# EasyEDA Pro project ProPrj_HydroNodeStation01_2026-04-19.epro, board PCB2
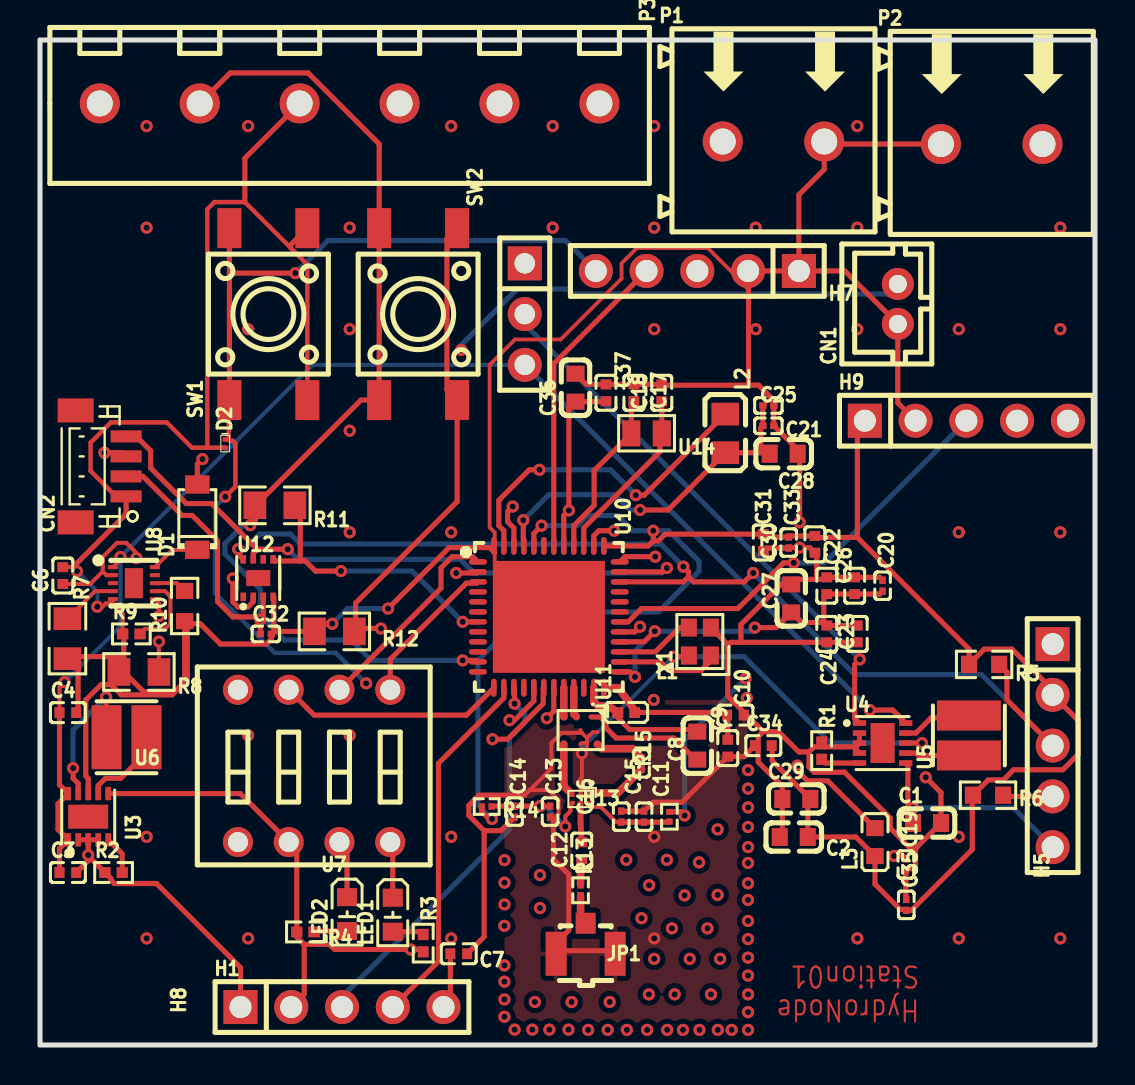
[diagram p2: board, top side]
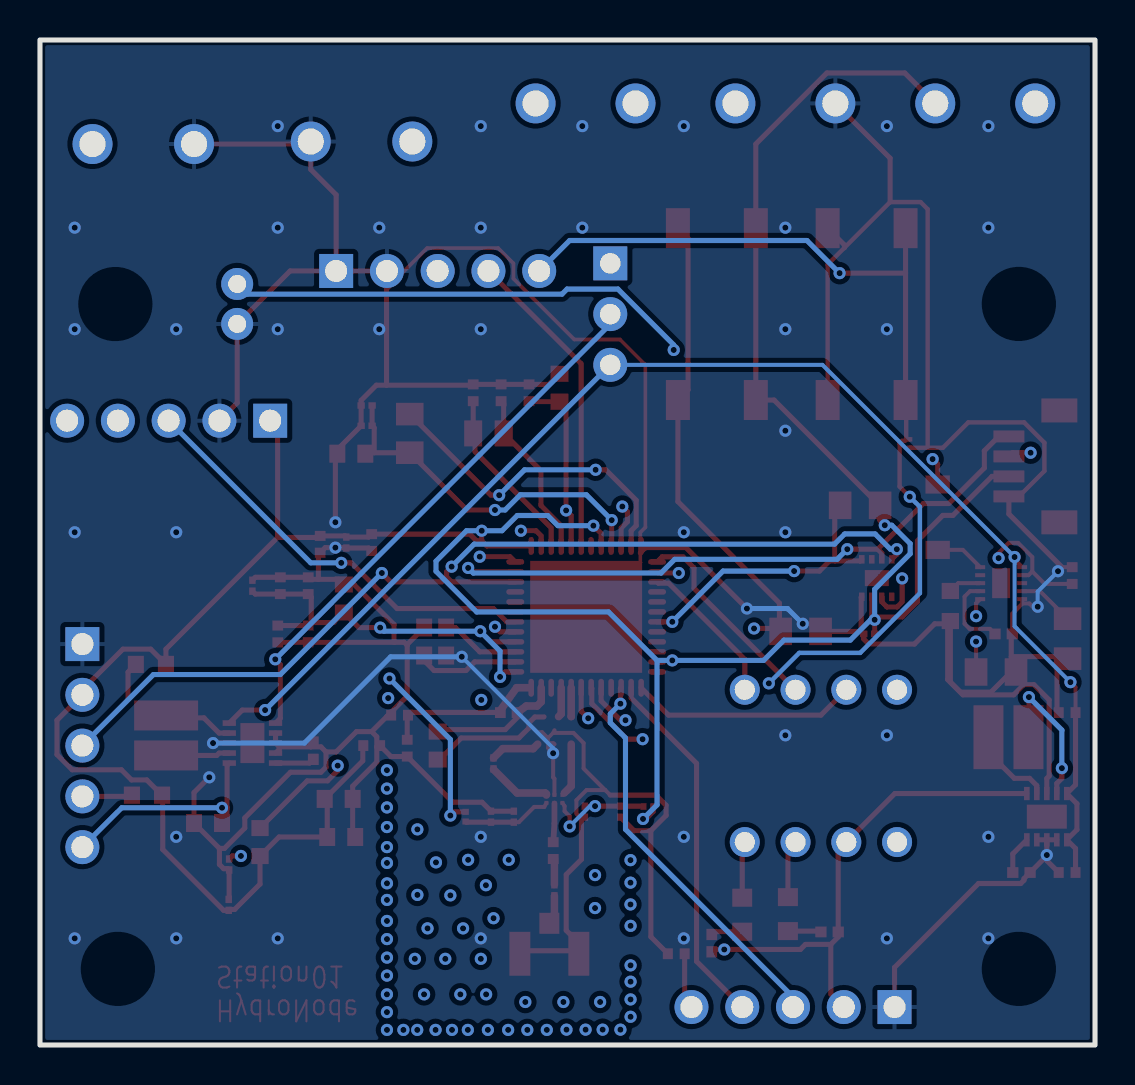
[diagram p3: board, bottom side, seen from below]

Outline 52.79 x 50.29 mm; copper layers: Top Layer, Inner1, Inner2, Bottom Layer. Coordinates in mm from the lower left corner of the outline.
Outline path: rectangle 0,50.29 52.79,0
Stack: Top Layer 0.035mm Outer layer thickness 1oz / Dielectric1 0.2104mm 7628 RC49% 8.6mil er 4.5 / Inner1 0.035mm Inner layer thickness / Dielectric2 1.065mm 1.1mm H/HOZ Copper / Inner2 0.035mm Inner layer thickness / Dielectric3 0.2104mm 7628 RC49% 8.6mil er 4.5 / Bottom Layer 0.035mm Outer layer thickness 1oz

## Design rules (mm)
template: JLCPCB Capability(Two Layers Board)
spacing copperThickness1oz (default): track to track 0.102, other pairs 0.152 to 0.3
spacing copperThickness2oz: track to track 0.203, other pairs 0.152 to 0.3
track width copperThickness1oz (default): min 0.127, default 0.254, max 2.54
track width copperThickness2oz: min 0.203, default 0.254, max 2.54
differential pair differentialPair (default): width min 0.127, default 0.254, max 2.54; gap min 0.152, default 0.152
via viaSize (default): diameter min 0.5, default 0.61, max 10; hole min 0.3, default 0.305, max 6.3

## Placement (name value [footprint] x y rotation side)
C1  22uF  [C0603]  44.38 11.11 0 top
C2  22uF  [C0603]  37.72 10.41 180 top
C3  10uF  [C0402]  1.4 8.63 0 top
C4  10uF  [C0402]  1.4 16.63 0 top
C6  100nF  [C0402]  1.14 23.49 90 top
C7  100nF  [C0402]  20.96 4.57 180 top
C8  100pF  [C0603]  32.89 14.98 90 top
C9  68pF  [C0402]  34.42 14.85 90 top
C10  47nF  [C0402]  34.8 16.5 180 top
C11  68pF  [C0201]  30.1 14.09 90 top
C12  68pF  [C0402]  27.11 9.73 90 top
C13  100nF  [C0201]  25.53 11.68 270 top
C14  1nF  [C0201]  23.75 11.68 270 top
C15  100nF  [C0201]  30.23 11.42 270 top
C16  1nF  [C0201]  29.08 11.42 270 top
C17  6.8pF  [C0402]  29.72 32.63 90 top
C18  6.8pF  [C0402]  31.12 32.63 90 top
C19  100nF  [C0201]  43.33 9.03 270 top
C20  33pF  [C0201]  42.16 22.98 270 top
C21  33pF  [C0201]  36.45 30.98 180 top
C22  100nF  [C0402]  39.37 22.98 270 top
C23  100nF  [C0402]  40.89 20.57 90 top
C24  100nF  [C0402]  39.37 20.57 90 top
C25  33pF  [C0201]  36.45 32 0 top
C26  100nF  [C0402]  40.77 22.98 90 top
C27  4.7uF  [C0603]  37.59 22.35 90 top
C28  470nF  [C0603]  37.21 29.59 0 top
C29  4.7uF  [C0603]  37.85 12.31 0 top
C30  100nF  [C0402]  36.19 25.14 270 top
C31  100nF  [C0402]  38.77 25.05 270 top
C32  100nF  [C0201]  11.3 20.57 0 top
C33  100nF  [C0201]  37.47 25.14 270 top
C34  100nF  [C0402]  36.19 14.98 0 top
C35  100nF  [C0201]  43.35 7.01 270 top
C36  4.7uF  [C0603]  26.8 32.89 90 top
C37  100nF  [C0402]  28.32 32.63 90 top
CN1  B2B-PH-K-S(LF)(SN)  [CONN-TH_B2B-PH-K-S]  42.93 37.08 90 top
CN2  BM04B-SRSS-TB(LF)(SN)  [CONN-SMD_BM04B-SRSS-TB]  3.05 28.95 90 top
D1  MBRX120LF-TP  [SOD-123_L2.7-W1.6-LS3.7-RD]  7.87 26.41 90 top
D2  ESDALC6V1-1U2  [DFN0603-D_L0.6-W0.3-P0.34-RD]  9.27 30.09 270 top
H1  PZ254V-11-05P  [HDR-TH_5P-P2.54-V-M]  15.11 1.9 0 top
H5  PZ254V-11-05P  [HDR-TH_5P-P2.54-V-M]  50.67 14.98 270 top
H7  PZ254V-11-05P  [HDR-TH_5P-P2.54-V-M]  32.89 38.73 180 top
H8  PZ254V-11-03P  [HDR-TH_3P-P2.54-V-M_PZ254V-11-03P]  24.26 36.57 270 top
H9  PZ254V-11-05P  [HDR-TH_5P-P2.54-V-M]  46.35 31.24 0 top
JP1  6GHz  [RF-SMD_FRF05002-JSS103M]  27.31 5.33 180 top
L1  47nH  [L0402]  29.34 16.63 180 top
L2  15uH  [L0805]  34.29 30.6 270 top
L3  FCM1608KF-601T03  [L0603]  41.78 10.16 90 top
LED1  YLED0603R  [LED0603-FD]  17.65 6.52 90 top
LED2  YLED0603R  [LED0603-FD]  15.37 6.55 90 top
P1  WJ500V-5.08-2P  [CONN-TH_2P-P5.00_WJ500V-5.08-2P]  36.7 45.21 0 top
P2  WJ500V-5.08-2P  [CONN-TH_2P-P5.00_WJ500V-5.08-2P]  47.62 45.08 0 top
P3  WJ126V-5.0-6P  [CONN-TH_6P-P5.00_WJ126V-5.0-6P]  15.49 47.11 270 top
R1  36.5kΩ  [R0402]  39.12 14.73 270 top
R2  16.2kΩ  [R0402]  3.68 8.63 0 top
R3  1kΩ  [R0402]  19.18 5.1 270 top
R4  1kΩ  [R0402]  13.28 5.66 180 top
R5  4.7kΩ  [R0603]  47.24 19.05 180 top
R6  4.7kΩ  [R0603]  47.44 12.5 180 top
R7  10kΩ  [R0805]  1.37 20.33 270 top
R8  10kΩ  [R0805]  4.95 18.66 180 top
R9  12kΩ  [R0402]  4.57 20.57 0 top
R10  300Ω  [R0603]  7.24 21.97 90 top
R11  10kΩ  [R0805]  11.75 27 180 top
R12  10kΩ  [R0805]  14.73 20.7 180 top
R13  0Ω  [R0201]  27.05 7.74 270 top
R14  100Ω  [R0201]  22.35 11.93 180 top
R15  100Ω  [R0201]  31.5 11.42 270 top
SW1  TS-1095PS-A1B2-C3D2  [KEY-SMD_4P-L6.0-W6.0-P3.90-LS9.0]  11.43 36.57 90 top
SW2  TS-1095PS-A1B2-C3D2  [KEY-SMD_4P-L6.0-W6.0-P3.90-LS9.0]  18.92 36.57 270 top
U3  TPS63900DSKR  [WSON-10_L2.5-W2.5-W0.50-TL-EP]  2.41 11.42 90 top
U4  TPS63900DSKR  [WSON-10_L2.5-W2.5-W0.50-TL-EP]  42.16 15.11 0 top
U5  2.2uH  [IND-SMD_L3.0-W3.0_LVF303012-4R7M-N]  46.48 15.49 90 top
U6  2.2uH  [IND-SMD_L3.0-W3.0_LVF303012-4R7M-N]  4.33 15.4 180 top
U7  SMQS-04R-TP  [SW-TH_8P-P2.54_SMQS-04R-TP]  13.72 13.97 180 top
U8  BQ25185DLHR  [WSON-10_L2.2-W2.0-P0.40-BL-EP_TI_DLH0010A]  4.7 23.11 270 top
U10  STM32WLE5CCU6  [UFQFPN-48_L7.0-W7.0-P0.50-BL-EP5.6]  25.46 21.42 270 top
U11  BALFHB-WL-02D3  [CSPG-8_L2.1-W1.8_BALFHB-WL-03D3]  27.05 15.74 270 top
U12  MAX17048G+T10  [TDFN-8_L2.0-W2.0-P0.50-BL-EP1.2]  10.92 23.36 0 top
U13  BGS12SN6E6327XTSA1  [TSNP-6_L1.1-W0.7-P0.40-BL]  27.05 12.31 180 top
U14  32.768kHz  [CRYSTAL-SMD_L2.0-W1.2]  30.35 30.6 180 top
X1  32MHz  [CRYSTAL-SMD_4P-L2.0-W1.6-BL]  33.02 20.19 90 top

## Footprints (pads in the part's own frame, mm; a bottom-side part is the same pattern mirrored in y, then rotated)
C0201
  rect 0.368x0.324 smd: 1(-0.275,0) 2(0.275,0)
C0402
  rect 0.5x0.54 smd: 1(-0.42,0) 2(0.42,0)
C0603
  rect 0.8x0.9 smd: 1(-0.7,0) 2(0.7,0)
CONN-SMD_BM04B-SRSS-TB
  rect 1.2x1.8 smd: 0(-2.8,1.262) 0(2.8,1.262)
  rect 0.6x1.55 smd: 1(-1.5,-1.262) 2(-0.5,-1.262) 3(0.5,-1.262) 4(1.5,-1.262)
CONN-TH_2P-P5.00_WJ500V-5.08-2P
  round 2 hole 1.3: 1(-2.54,0) 2(2.54,0)
CONN-TH_6P-P5.00_WJ126V-5.0-6P
  round 2 hole 1.3: 1(0,12.501) 2(0,7.5) 3(0,2.501) 4(0,-2.501) 5(0,-7.5) 6(0,-12.501)
CONN-TH_B2B-PH-K-S
  round 1.6 hole 0.9: 1(1,0) 2(-1,0)
CRYSTAL-SMD_4P-L2.0-W1.6-BL
  rect 0.9x0.8 smd: 1(-0.7,-0.55) 2(0.7,-0.55) 3(0.7,0.55) 4(-0.7,0.55)
CRYSTAL-SMD_L2.0-W1.2
  rect 0.9x1.3 smd: 1(-0.762,0) 2(0.762,0)
CSPG-8_L2.1-W1.8_BALFHB-WL-03D3
  round 0.204 smd: A1(-0.69,0.5) A2(-0.69,-0.21) A3(-0.69,-0.84) B1(0.085,0.84) B2(0,0) C1(0.69,0.84) C2(0.69,0) C3(0.69,-0.84)
DFN0603-D_L0.6-W0.3-P0.34-RD
  rect 0.22x0.26 smd: 1(-0.21,0) 2(0.21,0)
HDR-TH_3P-P2.54-V-M_PZ254V-11-03P
  rect 1.7x1.7 hole 1.02: 1(-2.54,0)
  round 1.7 hole 1.02: 2(0,0) 3(2.54,0)
HDR-TH_5P-P2.54-V-M
  rect 1.7x1.7 hole 1.1: 1(-5.08,0)
  round 1.7 hole 1.1: 2(-2.54,0) 3(0,0) 4(2.54,0) 5(5.08,0)
IND-SMD_L3.0-W3.0_LVF303012-4R7M-N
  rect 1.5x3.2 smd: 1(-1,0) 2(1,0)
KEY-SMD_4P-L6.0-W6.0-P3.90-LS9.0
  rect 2x1.2 smd: 1(-4.3,1.95) 2(4.3,1.95) 3(-4.3,-1.95) 4(4.3,-1.95)
L0402
  rect 0.54x0.54 smd: 1(-0.42,0) 2(0.42,0)
L0603
  rect 0.8x0.864 smd: 1(-0.7,0) 2(0.7,0)
L0805
  rect 1.133x1.377 smd: 1(-0.966,0) 2(0.966,0)
LED0603-FD
  rect 0.9x1 smd: 1(-0.85,0) 2(0.85,0)
R0201
  rect 0.303x0.324 smd: 1(-0.241,0) 2(0.241,0)
R0402
  rect 0.566x0.54 smd: 1(-0.433,0) 2(0.433,0)
R0603
  rect 0.806x0.864 smd: 1(-0.753,0) 2(0.753,0)
R0805
  rect 1.133x1.377 smd: 1(-1,0) 2(1,0)
RF-SMD_FRF05002-JSS103M
  rect 1x1.05 smd: 1(0,-0.762)
  rect 1.05x2.2 smd: 2(-1.475,0.762) 3(1.475,0.762)
SOD-123_L2.7-W1.6-LS3.7-RD
  rect 0.91x1.22 smd: 1(-1.635,0) 2(1.635,0)
SW-TH_8P-P2.54_SMQS-04R-TP
  round 1.5 hole 1: 1(-3.81,-3.81) 2(-1.27,-3.81) 3(1.27,-3.81) 4(3.81,-3.81) 5(3.81,3.81) 6(1.27,3.81) 7(-1.27,3.81) 8(-3.81,3.81)
TDFN-8_L2.0-W2.0-P0.50-BL-EP1.2
  rect 0.28x0.425 smd: 1(-0.75,-0.938) 2(-0.25,-0.938) 3(0.25,-0.938) 4(0.75,-0.938) 5(0.75,0.938) 6(0.25,0.938) 7(-0.25,0.938) 8(-0.75,0.938)
  rect 1.2x0.8 smd: 9(0,0)
TSNP-6_L1.1-W0.7-P0.40-BL
  rect 0.2x0.2 smd: 1(-0.4,-0.2) 2(0,-0.2) 3(0.4,-0.2) 4(0.4,0.2) 5(0,0.2) 6(-0.4,0.2)
UFQFPN-48_L7.0-W7.0-P0.50-BL-EP5.6
  oval 0.28x0.9 smd: 1(-2.751,-3.547) 2(-2.251,-3.547) 3(-1.75,-3.547) 4(-1.25,-3.547) 5(-0.75,-3.547) 6(-0.249,-3.547) 7(0.249,-3.547) 8(0.75,-3.547) 9(1.25,-3.547) 10(1.75,-3.547) 11(2.251,-3.547) 12(2.751,-3.547) 25(2.751,3.547) 26(2.251,3.547) 27(1.75,3.547) 28(1.25,3.547) 29(0.75,3.547) 30(0.249,3.547) 31(-0.249,3.547) 32(-0.75,3.547) 33(-1.25,3.547) 34(-1.75,3.547) 35(-2.251,3.547) 36(-2.751,3.547)
  oval 0.9x0.28 smd: 13(3.547,-2.75) 14(3.547,-2.25) 15(3.547,-1.75) 16(3.547,-1.25) 17(3.547,-0.75) 18(3.547,-0.25) 19(3.547,0.25) 20(3.547,0.75) 21(3.547,1.25) 22(3.547,1.75) 23(3.547,2.25) 24(3.547,2.75) 37(-3.547,2.751) 38(-3.547,2.251) 39(-3.547,1.75) 40(-3.547,1.25) 41(-3.547,0.75) 42(-3.547,0.249) 43(-3.547,-0.249) 44(-3.547,-0.75) 45(-3.547,-1.25) 46(-3.547,-1.75) 47(-3.547,-2.251) 48(-3.547,-2.751)
  rect 5.6x5.6 smd: 49(0,0)
WSON-10_L2.2-W2.0-P0.40-BL-EP_TI_DLH0010A
  rect 0.2x0.5 smd: 1(-0.8,-1.05) 2(-0.4,-1.05) 3(0,-1.05) 4(0.4,-1.05) 5(0.8,-1.05) 6(0.8,1.05) 7(0.4,1.05) 8(0,1.05) 9(-0.4,1.05) 10(-0.8,1.05)
  rect 1.5x0.9 smd: 11(0,0)
WSON-10_L2.5-W2.5-W0.50-TL-EP
  rect 0.665x0.28 smd: 1(-1.157,1) 2(-1.157,0.5) 3(-1.157,0) 4(-1.157,-0.5) 5(-1.157,-1) 6(1.157,-1) 7(1.157,-0.5) 8(1.157,0) 9(1.157,0.5) 10(1.157,1)
  rect 1.2x2 smd: 11(0,0)

## Nets
As in the schematic.

Pads without a net: CN2 0; H9 4 5; U3 11; U4 11; U7 4 5; U8 3 9 11; U10 5 6 8 9 10 12 16 22 31 32 33 43; U12 1 6 9

## Via types
v1: diameter 0.61, hole 0.305, Top Layer to Bottom Layer, 164 vias

## Routing (per net, layer and track width the routed paths; a pad name or vN(x,y) marks a point on that pad's centre or on a via; arc(x,y) is an arc through that point)
+5V: length 83.2
  Top Layer w0.254: 43.43,11.87 43.43,14 U4.6 ; 43.43,11.87 43.43,11.36 C1.1 ; 43.43,11.87 v1(43.69,11.87)
  Inner2 w0.254: v1(43.69,11.87) 36.57,18.98 36.57,44.64 32.07,49.14 5.03,49.14 P3.6
  Bottom Layer w0.254: v1(43.69,11.87) 48.7,11.87 H5.5
GND: length 341.7
  Top Layer w0.184: 27.37,15.36 27.67,15.66 U11.B1 ; 27.37,15.36 27.05,15.68 U11.B2 ; 27.37,15.36 27.37,15.11 ; v1(27.12,14.6) 27.37,14.85 27.37,15.11 ; U11.C2 27.11,15.11 27.37,15.11 ; U10.49 22.75,24.13 22.75,25.65 22.5,25.9 22.5,34.03 23.77,35.3 26.06,35.3 29.1,38.35 29.1,39.11 29.87,39.87 33.42,39.87 35.2,38.09
  Top Layer w0.2: v1(2.87,21.93) 3.12,21.93 3.29,22.09 3.63,22.09 ; v1(27.12,14.6) 27.12,13.39 27.05,13.33 U13.2 ; R9.1 4.14,21.58 3.63,22.09 ; 24.51,12.76 25.59,13.84 25.59,15.11 26.1,15.62 27.12,15.62 ; 24.51,12.76 25.44,12.76 25.95,12.25 25.95,11.58 25.7,11.32 25.61,11.32 C13.2 ; 24.51,12.76 24.26,12.5 ; 3.63,22.09 U8.5 ; C6.2 1.65,23.91 v1(1.85,23.71)
  Top Layer w0.22: 8.37,29.88 8.37,41.82 8.73,42.18 10.25,42.18 13.38,39.05 SW1.3 ; 8.37,29.88 D2.2 ; 8.37,29.88 7.61,29.88 6.34,31.15 3.55,31.15 2.53,30.14 2.53,28.72 3.8,27.45 CN2.1
  Top Layer w0.254: v1(44.32,13.39) 45.09,12.63 C1.2 43.81,9.84 ; v1(17.42,21.84) 20.47,24.89 22.5,24.89 22.75,24.63 ; C30.2 36.34,24.87 C33.2 37.49,24.89 v1(38.01,24.89) 38.52,24.89 C31.2 38.86,24.55 38.86,23.3 ; R7.2 1.48,19.43 1.91,19.43 ; JP1.2 28.63,4.72 25.95,4.72 ; 43.81,9.84 43.56,9.84 42.54,10.86 42.54,11.36 40.26,13.65 38.74,13.65 38.48,13.9 38.48,14.67 ; 43.81,9.84 43.81,9.03 43.6,8.82 43.39,8.82 C19.2 43.33,7.31 43.35,7.29 ; H7.1 40.28,38.73 CN1.2 42.93,32.13 H9.2 ; H7.1 H7.2 35.2,38.5 35.2,38.09 35.45,37.84 35.45,33.02 ; H7.1 37.97,42.54 39.24,43.81 39.24,45.08 ; C3.2 2.41,9.23 2.41,9.47 ; U4.4 40.82,14.8 40.82,14.92 ; C36.2 27.33,33.05 C37.2 C17.2 C18.2 31.15,33.02 35.45,33.02 ; C4.2 1.91,16.72 1.91,19.43 ; 39.24,14.92 40.82,14.92 ; 39.24,14.92 38.74,14.92 38.48,14.67 ; 39.24,14.92 39.24,15.03 R1.1 ; 40.82,14.92 U4.3 U4.2 ; v1(44.13,15.11) U4.8 ; U3.8 2.41,13.34 2.29,13.46 2.29,17.27 3.06,18.03 3.56,18.03 4.07,17.52 6.61,17.52 7.37,18.28 7.37,21.08 ; 22.22,10.72 22.22,5.42 C7.1 ; 22.22,10.72 21.46,11.49 21.46,12 21.97,12.5 24.26,12.5 ; 22.22,10.72 23.07,10.72 C14.2 ; 22.75,25.14 U10.48 ; 1.91,19.43 4.19,19.43 ; 7.37,21.08 R10.1 7.24,18.16 6.73,17.66 5.21,17.66 4.19,18.67 ; 7.37,21.08 8.02,21.08 9.04,20.06 11.32,20.06 11.58,20.31 C32.2 11.7,20.7 ; 39.24,45.08 P1.2 ; 39.24,45.08 P2.1 ; 11.7,20.7 R12.2 14.11,21.08 v1(14.63,21.08) ; 11.7,20.7 11.7,22.4 U12.4 ; 12.54,39.89 12.54,40.03 SW1.4 ; 4.19,18.67 R8.2 ; 4.19,18.67 4.19,19.43 ; U3.3 U3.2 ; U3.3 v1(2.41,9.51) 2.41,9.47 ; U3.3 U3.4 ; 38.86,23.3 37.85,23.3 C27.2 37.08,23.05 35.07,21.04 35.07,20.15 ; 38.86,23.3 39.27,23.3 C22.1 C26.2 42.02,23.4 C20.1 ; 34.42,20 34.42,20.04 X1.2 ; 34.42,20 34.57,20.15 35.07,20.15 ; 34.42,20 34.42,17.46 35.43,16.44 ; 35.45,33.02 35.96,33.02 36.72,32.25 C25.2 C21.1 37.91,29.79 C28.2 38.01,29.49 v1(38.01,26.16) ; 10.25,42.18 10.25,44.37 P3.4 ; 35.94,14.92 35.84,14.92 C34.1 35.23,14.43 C9.1 32.13,12.15 30.67,12.15 C15.1 C16.1 ; 35.94,14.92 35.94,15.43 36.19,15.68 ; 35.94,14.92 35.94,14.16 37.15,12.95 C29.1 37.15,10.54 C2.2 ; 25.7,11.32 25.7,9.29 26.46,8.53 26.46,5.73 25.95,5.23 25.95,4.72 ; 4.19,19.43 4.19,20.52 R9.1 ; v1(31.69,19.43) 32.41,19.43 X1.4 ; 38.48,14.67 37.97,14.67 36.96,15.68 36.19,15.68 ; 35.07,20.15 C24.1 C23.1 ; 35.43,16.44 35.28,16.44 C10.1 ; 35.43,16.44 36.19,15.68 ; H1.1 10.03,3.88 5.83,8.08 3.72,8.08 3.55,8.25 3.55,8.33 3.25,8.63 2.41,9.47 ; CN2.1 4.31,26.57 1.65,23.91 ; 25.95,4.72 JP1.3
  Inner2 w0.254: 44.32,14.92 45.53,14.92 50.67,20.06 ; 44.32,14.92 v1(44.13,15.11) ; 44.32,14.92 v1(44.32,13.39) ; v1(38.01,24.89) v1(38.01,26.16) ; v1(2.41,9.51) 2.41,21.47 v1(2.87,21.93)
  Bottom Layer w0.2: v1(27.12,14.6) 27.12,14.85 v1(31.69,19.43) ; v1(1.85,23.71) 2.87,22.69 v1(2.87,21.93)
  Bottom Layer w0.254: v1(44.13,15.11) 39.56,15.11 35.24,19.43 v1(31.69,19.43) ; v1(17.42,21.84) 15.39,21.84 v1(14.63,21.08)
  vias: v1(5.34,45.98) v1(5.34,40.9) v1(5.34,10.42) v1(5.34,5.34) v1(10.42,45.98) v1(10.42,35.82) v1(10.42,15.5) v1(10.42,5.34) v1(15.5,40.9) v1(15.5,35.82) v1(15.5,30.74) v1(15.5,25.66) v1(15.5,15.5) v1(20.58,45.98) v1(20.58,25.66) v1(20.58,10.42) v1(20.58,5.34) v1(25.66,45.98) v1(25.66,40.9) v1(30.74,45.98) v1(30.74,40.9) v1(30.74,35.82) v1(30.74,10.42) v1(30.74,5.34) v1(35.82,40.9) v1(35.82,35.82) v1(40.9,45.98) v1(40.9,40.9) v1(40.9,35.82) v1(40.9,5.34) v1(45.98,35.82) v1(45.98,25.66) v1(45.98,10.42) v1(45.98,5.34) v1(51.06,40.9) v1(51.06,35.82) v1(51.06,25.66) v1(51.06,5.34)
VCC: length 195
  Top Layer w0.254: 10.77,26.98 10.77,26.26 v1(10.52,26.01) ; 10.77,26.98 16.06,32.27 SW2.4 SW2.3 16.97,45.08 13.42,48.64 9.52,48.64 P3.5 ; 10.77,26.98 R11.2 ; v1(25.1,25.99) 24.71,25.6 U10.44 ; R14.2 22.11,11.68 22.48,11.31 v1(22.62,11.31) ; 13.22,5.03 14.49,5.03 14.74,4.78 v1(18.55,4.78) 19.06,4.78 R3.2 ; 13.22,5.03 12.85,5.4 R4.2 12.85,9.75 U7.6 10.02,12.58 U3.6 ; 13.22,5.03 13.22,2.55 H1.2 ; 38.42,12.19 C2.1 40.83,10.41 L3.1 41.78,8.05 43.05,6.78 43.31,6.78 C35.2 43.6,6.74 46.65,9.79 46.65,12.47 R6.2 47.45,13.26 48.21,13.26 48.72,13.77 51.18,13.77 51.94,14.53 51.94,16.25 H5.2 50.67,17.78 48.64,19.81 47.25,19.81 R5.2 46.49,19.81 40.9,25.39 ; 38.42,12.19 38.42,12.44 36.64,14.22 36.64,14.95 C34.2 ; 38.42,12.19 C29.2 ; U10.11 21.84,19.24 v1(21.15,19.24) ; 30.69,25.22 v1(30.69,25.73) ; 30.69,25.22 30.94,25.22 31.28,25.56 C30.1 36.34,25.42 C33.1 37.52,25.47 C31.1 38.85,25.39 40.9,25.39 ; 30.69,25.22 30.44,24.97 U10.37 ; CN2.2 5.16,28.45 7.11,26.5 7.62,26.5 8.89,25.23 8.89,22.18 9.65,21.42 11.17,21.42 ; 11.17,21.42 v1(11.03,21.28) C32.1 ; 11.17,21.42 U12.3 ; 40.9,25.39 40.9,30.86 H9.1
  Inner2 w0.254: v1(22.62,11.31) 22.62,9.53 18.55,5.47 v1(18.55,4.78)
  Bottom Layer w0.254: 21.92,19.24 21.92,12.01 v1(22.62,11.31) ; 21.92,19.24 24.34,21.67 30.94,21.67 32.98,23.7 32.98,24.21 31.45,25.73 v1(30.69,25.73) 29.67,25.73 28.91,26.49 27.39,26.49 26.88,25.99 v1(25.1,25.99) ; 21.92,19.24 v1(21.15,19.24) 16.58,19.24 15.57,20.26 12.24,20.26 11.23,21.28 v1(11.03,21.28) 11.03,22.8 9.25,24.58 9.25,25.09 10.17,26.01 v1(10.52,26.01)
VDDA: length 31.8
  Top Layer w0.254: U10.41 26.21,26.49 v1(26.47,26.75) 26.47,31.86 C36.1 28.29,32.19 C37.1 ; L3.2 39.42,13.22 38.4,13.22 37.9,13.73 v1(37.9,13.98)
  Inner2 w0.254: v1(26.47,26.75) 26.47,26.49 34.59,18.37 34.59,17.28 v1(37.9,13.98)
VDDPA: length 32.9
  Top Layer w0.254: v1(30.77,20.7) 30.23,20.17 U10.28 ; v1(23.65,26.94) 23.4,26.69 23.4,26.18 23.71,25.87 U10.46 ; C20.2 42.02,22.56 C26.1 C22.2 39.22,22.41 39.22,21.14 ; v1(35.77,20.89) 36.83,20.89 C27.1 38.1,21.14 39.22,21.14 ; U10.25 29.52,18.67 v1(29.77,18.42) ; 39.22,21.14 C24.2 C23.2
  Inner2 w0.254: v1(30.77,20.7) 30.77,21.21 25.03,26.94 v1(23.65,26.94)
  Bottom Layer w0.254: v1(35.77,20.89) 35.59,20.7 v1(30.77,20.7) 29.77,19.71 v1(29.77,18.42)
VDDRF1V55: length 27.4
  Top Layer w0.254: 36.07,29.64 36.07,30.88 C21.2 C25.1 ; 36.07,29.64 L2.2 31.42,26.77 v1(30.03,26.77) ; 36.07,29.64 36.46,29.64 C28.1 ; v1(30.03,20.93) 29.77,20.67 U10.29 ; U10.45 24.18,25 v1(24.18,26.26)
  Inner2 w0.254: v1(24.18,26.26) 24.44,26.01 24.44,25.75 29.26,20.93 v1(30.03,20.93)
  Bottom Layer w0.254: v1(30.03,26.77) 29.52,26.77 28.76,27.53 25.45,27.53 v1(24.18,26.26)
(no net):
  vias: v1(23.25,9.25) v1(23.25,8.12) v1(23.25,7.03) v1(23.24,5.96) v1(23.24,3.99) v1(23.24,3.17) v1(23.24,2.28) v1(23.24,1.41) v1(23.75,0.77) v1(24.64,0.77) v1(24.76,2.15) v1(25.02,8.5) v1(25.02,6.85) v1(25.49,0.77) v1(26.45,0.77) v1(26.6,2.15) v1(27.43,0.76) v1(28.41,0.76) v1(28.51,2.15) v1(29.34,9.27) v1(29.37,0.76) v1(30.1,6.34) v1(30.38,0.76) v1(30.48,8) v1(30.47,2.53) v1(30.71,17.27) v1(30.73,4.31) v1(31.37,9.27) v1(31.38,0.76) v1(31.62,5.84) v1(31.76,2.53) v1(32.26,7.49) v1(32.18,0.76) v1(32.51,4.31) v1(32.98,9.14) v1(33,0.76) v1(33.4,5.84) v1(33.57,2.53) v1(33.91,10.79) v1(33.91,7.51) v1(33.92,0.76) v1(34.04,4.31) v1(34.61,0.76) v1(35.37,17.36) v1(35.43,13.75) v1(35.43,12.83) v1(35.43,11.89) v1(35.43,10.91) v1(35.43,9.9) v1(35.43,9.11) v1(35.43,8.09) v1(35.43,7.26) v1(35.43,6.21) v1(35.43,5.3) v1(35.43,4.37) v1(35.43,3.47) v1(35.43,2.53) v1(35.43,1.65) v1(35.43,0.76)
BOOT: length 35.8
  Top Layer w0.254: 15.79,20.84 R12.1 ; 15.79,20.84 15.79,22.11 20.87,27.19 SW2.2 20.37,32.78 20.37,40.36 SW2.1 ; 15.79,20.84 v1(17.06,20.84) ; v1(25.36,16.35) 25.71,16.7 U10.19
  Inner2 w0.254: v1(25.36,16.35) 23.84,17.88 20.03,17.88 v1(17.06,20.84)
CLK: length 15.7
  Top Layer w0.254: U10.42 25.71,34.09 H7.4
DIO: length 17.1
  Top Layer w0.254: U10.36 29.27,24.43 v1(30.79,24.43)
  Inner2 w0.254: v1(30.79,24.43) 32.89,26.54 H7.3
EN5V: length 31.1
  Top Layer w0.254: U10.17 24.71,17.22 23.75,16.25 v1(23.5,16.25)
  Inner2 w0.254: v1(23.5,16.25) 24,15.74 25.78,15.74 26.03,16 26.03,16.5 22.99,19.55 22.99,27.68 25.53,30.22 25.53,37.84 H8.1
LED1: length 2.8
  Top Layer w0.254: LED1.2 17.65,10.03 U7.8
LED2: length 2.9
  Top Layer w0.254: LED2.2 15.37,9.77 U7.7
LIPOPLUS: length 69.2
  Top Layer w0.2: 3.65,23.91 4.03,24.28 v1(4.03,24.42) ; v1(1.23,18.16) 0.98,17.9 C4.1
  Top Layer w0.254: C4.1 0.98,13.02 U3.10 0.91,12.07 0.91,10.78 U3.1 0.98,9.83 C3.1 ; U4.10 42.67,16.76 v1(41.53,16.76)
  Bottom Layer w0.2: H8.3 13.64,34.03 v1(4.03,24.42) 4.03,20.95 v1(1.23,18.16)
  Bottom Layer w0.254: H8.3 v1(41.53,16.76)
PA0: length 14.4
  Top Layer w0.254: U12.5 11.75,24.22 13.03,24.22 ; U10.7 v1(21.15,21.17) ; v1(15.06,23.71) 13.79,23.71 13.28,24.22 13.03,24.22 ; 13.03,24.22 13.03,26.73 R11.1
  Bottom Layer w0.254: v1(15.06,23.71) 18.61,23.71 v1(21.15,21.17)
PB0: length 21.5
  Top Layer w0.254: U10.30 29.43,21.17 30.1,21.84 34.93,21.84 37.21,24.12 v1(37.72,24.12)
  Bottom Layer w0.254: v1(37.72,24.12) 39.24,24.12 H9.3
PB3: length 10.4
  Top Layer w0.254: U7.2 20.07,22.86 20.07,23.87 20.62,24.43 21.66,24.43 U10.1
PB4: length 23.3
  Top Layer w0.254: v1(20.83,23.62) 21.86,23.62 U10.2 ; U7.3 13.72,16.5 21.34,16.5 U10.13
  Inner2 w0.254: v1(20.83,23.62) 18.29,23.62 U7.3
PB5: length 7.5
  Top Layer w0.254: U10.3 21.85,23.11 21.34,23.11 17.53,19.3 U7.1
PC13: length 20.7
  Top Layer w0.254: v1(28.73,25.73) 27.97,25.73 27.71,25.48 U10.38 ; v1(32.26,11.48) 32.07,11.67 R15.1
  Inner2 w0.254: v1(35.31,18.34) 28.73,24.92 v1(28.73,25.73)
  Bottom Layer w0.254: v1(32.26,11.48) 32.26,15.29 v1(35.31,18.34)
RST: length 102
  Top Layer w0.22: 9.45,30.3 9.53,30.23 9.65,30.23 9.78,30.1 9.78,27.94 v1(9.27,27.43) ; 9.45,30.3 D2.1 ; 9.45,30.3 9.45,32.24 9.48,32.27
  Top Layer w0.254: C19.1 43.17,9.46 v1(42.74,9.46) ; 9.48,32.27 9.48,38.62 ; 9.48,38.62 9.48,40.87 ; 9.48,38.62 v1(12.78,38.62) ; H1.5 20.53,2.24 C7.2 ; U10.18 25.18,17.84 25.18,17.08 23.4,15.3 v1(22.64,15.3)
  Inner2 w0.22: v1(16.32,18.1) 16.32,17.33 19.37,14.29 21.4,14.29
  Inner2 w0.254: 21.62,14.29 22.67,14.29 23.94,13.02 25.21,13.02 ; 21.62,14.29 v1(22.64,15.3) ; 21.62,14.29 21.4,14.29 ; 25.21,13.02 33.59,13.02 35.12,14.54 35.63,14.54 40.71,9.46 v1(42.74,9.46) ; 25.21,13.02 24,11.81 24,5.71 H1.5
  Bottom Layer w0.22: v1(9.27,27.43) 8.76,26.93 8.76,22.61 11.75,19.62 14.8,19.62 v1(16.32,18.1)
  Bottom Layer w0.254: H7.5 26.29,40.25 14.41,40.25 v1(12.78,38.62)
RX: length 20
  Top Layer w0.254: v1(23.75,17.08) 23.75,17.84 U10.15
  Bottom Layer w0.254: H1.3 15.11,2.41 23.5,10.79 23.5,15.36 24.26,16.12 24.26,16.57 v1(23.75,17.08)
SCL: length 88.3
  Top Layer w0.254: R6.1 48.25,12.44 50.67,12.44 ; CN2.4 4.82,30.45 5.54,29.73 5.54,28.87 7.32,27.09 8.59,27.09 10.87,24.81 ; U12.7 10.67,24.61 10.87,24.81 ; 10.87,24.81 v1(12.4,24.81) ; U10.35 31.17,23.67 v1(31.37,23.87)
  Inner2 w0.254: 50.67,12.44 49.4,11.17 43.31,11.17 31.37,23.11 v1(31.37,23.87) ; P3.2 22.99,35.4 v1(12.4,24.81)
  Bottom Layer w0.254: v1(31.37,23.87) 31.12,23.62 21.72,23.62 21.03,24.3 12.91,24.3 v1(12.4,24.81)
SDA: length 88.1
  Top Layer w0.254: 32.45,23.43 32.7,23.17 35.24,23.17 v1(35.69,23.62) ; 32.45,23.43 32.19,23.17 U10.34 ; 32.45,23.43 32.45,23.68 v1(32.19,23.94) ; H5.3 48.39,17.27 48.39,18.66 R5.1 ; U12.8 9.92,24.55 v1(9.92,24.81) ; v1(3.22,29.63) 4.13,29.63 CN2.3
  Inner2 w0.254: P3.3 11.18,40.29 11.18,35.21 5.35,29.38 ; v1(9.92,24.81) 5.35,29.38 ; 5.35,29.38 3.48,29.38 v1(3.22,29.63)
  Bottom Layer w0.254: v1(32.19,23.94) 31.07,25.06 13.03,25.06 12.53,25.57 11,25.57 10.24,24.81 v1(9.92,24.81) ; H5.3 47.12,18.54 40.77,18.54 v1(35.69,23.62)
SOLARPLUS: length 39.6
  Top Layer w0.254: v1(8.13,29.32) 7.87,29.06 D1.2
  Inner2 w0.254: P1.1 32.26,47.11 P3.1 26.49,48.62 22.61,48.62 21.59,47.6 21.59,42.78 v1(8.13,29.32)
TX: length 18.3
  Top Layer w0.254: H1.4 19.94,4.19 19.94,14.09 23.21,17.37 U10.14
$1N2497: length 4.3
  Top Layer w0.254: U3.7 2.91,12.98 3.28,13.34 4.04,13.34 5.31,14.61 5.31,15.38 U6.1
$1N2498: length 7.6
  Top Layer w0.254: v1(3.31,17.41) 3.31,15.42 U6.2 ; v1(1.66,13.85) 1.66,13.34 1.91,13.09 U3.9
  Bottom Layer w0.254: v1(1.66,13.85) 1.66,15.76 v1(3.31,17.41)
$1N2499: length 3.5
  Top Layer w0.254: U4.9 43.83,15.61 44.59,16.37 46.36,16.37 U5.2
$1N2500: length 3.2
  Top Layer w0.254: U5.1 43.95,14.49 43.83,14.61 U4.7
$1N2509: length 1.9
  Top Layer w0.254: R2.2 4.12,9.56 U3.5
$1N2510: length 2
  Top Layer w0.254: U4.5 39.3,14.11 R1.2
$1N2511: length 27.6
  Top Layer w0.254: U4.1 40.77,16.35 40.77,19.05 v1(41.02,19.3)
  Bottom Layer w0.254: H8.2 24.26,36.06 v1(41.02,19.3)
$1N2534: length 1.6
  Top Layer w0.254: 19.18,5.53 19.04,5.67 LED1.1
$1N2535: length 1.7
  Top Layer w0.254: R4.1 13.76,5.7 LED2.1
$1N2561: length 63.8
  Top Layer w0.2: v1(4.83,24.36) 4.83,24.62 4.32,25.12 3.85,25.12 3.14,24.42 3.14,23.69 ; 3.14,23.69 3.33,23.51 U8.2 ; 3.14,23.69 2.52,23.07 C6.1
  Top Layer w0.254: v1(9.65,23.35) 9.65,22.17 9.91,21.92 10.41,21.92 10.67,22.18 U12.2
  Inner2 w0.2: v1(4.83,24.36) 5.84,23.35 v1(9.65,23.35)
  Inner2 w0.254: v1(21.08,34.78) v1(9.65,23.35) ; CN1.1 43.16,38.08 P2.2
  Bottom Layer w0.254: v1(21.08,34.78) 21.08,35.03 23.88,37.83 26.42,37.83 26.67,37.57 42.42,37.57 CN1.1
$1N2563: length 2.8
  Top Layer w0.2: 3.65,22.71 2.75,22.71 R7.1
$1N2564: length 2.5
  Top Layer w0.2: D1.1 6.62,24.78 5.75,23.91
$1N2566: length 3.7
  Top Layer w0.2: v1(5.95,21.46) 5.95,22.11 U8.6 ; R8.1 v1(5.95,20.19)
  Inner2 w0.2: v1(5.95,20.19) v1(5.95,21.46)
$1N2567: length 4
  Top Layer w0.2: 5.75,22.71 6.26,22.71 6.53,22.44 6.53,21.08 6.28,20.82 5.26,20.82 R9.2
$1N2569: length 1.7
  Top Layer w0.2: U8.8 6.85,23.11 R10.2
$1N6744: length 5.9
  Top Layer w0.2: U13.4 26.54,11.95 26.54,11.7 26.29,11.45 v1(26.29,10.94) ; C13.1 v1(25.02,11.95)
  Top Layer w0.254: v1(25.02,11.95) C14.1 22.61,11.95 R14.1
  Bottom Layer w0.2: v1(25.02,11.95) 25.27,11.95 v1(26.29,10.94)
$1N7058: length 4.5
  Top Layer w0.2: U13.6 27.56,11.91 28.07,11.91 28.83,11.15 C16.2
  Top Layer w0.254: C16.2 C15.2 31.46,11.15 R15.2
$1N7436: length 4
  Top Layer w0.254: X1.3 32,20.89 30.79,19.67 U10.27
$1N7448: length 5.2
  Top Layer w0.254: X1.1 33.57,19.23 33.07,18.74 31.48,18.74 31.04,19.17 U10.26
$1N7626: length 8.5
  Top Layer w0.254: C17.1 29.59,32.09 U14.2 27.73,28.74 27.73,27 26.71,25.99 U10.40
$1N7632: length 8.9
  Top Layer w0.254: U10.39 27.21,25.88 31.02,29.69 31.02,30.51 U14.1 C18.1
$1N11363: length 16.6
  Top Layer w0.254: U10.47 23.21,25.73 22.96,25.99 22.96,27.26 24.48,28.78 v1(24.99,28.78) ; L2.1 30.23,27.51 v1(29.82,27.51)
  Bottom Layer w0.254: v1(29.82,27.51) 28.55,28.78 v1(24.99,28.78)
$1N5916: length 1.5
  Top Layer w0.38: U10.21 26.71,16.56 26.84,16.43
$1N5921: length 1.4
  Top Layer w0.38: U10.20 26.21,16.44 26.21,16.43
$1N5997: length 6.4
  Top Layer w0.254: 27.58,16.41 28.03,16.41 28.32,16.12 28.32,15.87 28.83,15.36 31.71,15.36 32.89,14.18
$1N6001: length 6.5
  Top Layer w0.254: 28.79,16.63 28.79,16.5 29.51,15.78 32.77,15.78
  Top Layer w0.38: U10.23 27.71,17.17 27.92,16.96 28.46,16.96 L1.2
$1N6167: length 8
  Top Layer w0.254: 29.77,16.64 34.24,16.64 34.42,16.47 C9.2
  Top Layer w0.38: 28.34,17.88 28.94,17.88 29.84,16.63
$1N6399: length 2.5
  Top Layer w0.38: U11.C1 28.12,14.83 29.64,14.83 C11.2
$1N6407: length 3.2
  Top Layer w0.38: 27.45,12.51 27.45,12.56 27.5,12.61 28.92,12.61 30.1,13.79
$1N6414: length 2.6
  Top Layer w0.38: U11.C3 26.21,12.95 26.55,12.61
$1N6545: length 2
  Top Layer w0.29: 27.05,12.08 27.05,11.09 27.11,10.12
$1N6584: length 1.3
  Top Layer w0.38: 27.05,8.04 27.05,9.35
$1N6623: length 1.4
  Top Layer w0.38: 27.05,7.44 27.05,6.09

## Copper pours and planes (outline as drawn; the poured copper is in the pictures)
GND on Top Layer: 23.24,17.27 35.43,17.27 35.43,0.77 23.24,0.77
GND on Bottom Layer: 0.25,50.03 52.79,50.03 52.79,0 0.25,0
GND on Inner1: 0.26,50.03 52.54,50.03 52.54,0.26 0.26,0.26

Small or netless copper shapes (teardrops, artwork), in the pictures only: 48 on Inner1

## Text on the board
Top Layer: HydroNode / Station01
